# EAGLE design mic_v3 (EAGLE 9.6.2)
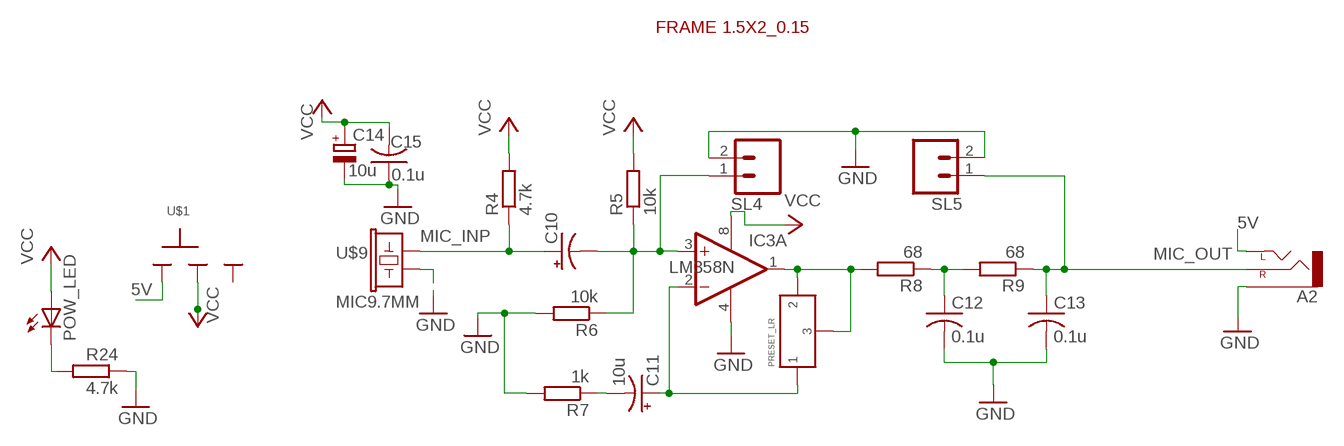
[diagram p0: schematic, sheet 1]

## Parts
A2  AUDIO-JACKPTH  [AUDIO-JACK]
C10  CPOL-USE2.5-5  [E2,5-5]
C11  10u  CPOL-USE2.5-5  [E2,5-5]
C12  0.1u  C-US025-024X044  [C025-024X044]
C13  0.1u  C-US025-024X044  [C025-024X044]
C14  10u  CPOL-EUE2.5-5  [E2,5-5]
C15  0.1u  C-US025-024X044  [C025-024X044]
IC3  LM358N  [DIL08]
POW_LED  LED3MM  [LED3MM]
R4  4.7k  R-EU_0204/7  [0204/7]
R5  10k  R-EU_0204/7  [0204/7]
R6  10k  R-EU_0204/7  [0204/7]
R7  1k  R-EU_0204/7  [0204/7]
R8  68  R-EU_0204/7  [0204/7]
R9  68  R-EU_0204/7  [0204/7]
R24  4.7k  R-EU_0204/7  [0204/7]
SL4  M02  [02P]
SL5  M02  [02P]
U$1  SLIDESWITCH-BIG  [BIGSWITCH]
U$2  FRAME_1.5X2_RAD_0.15  [FRAME_1.5X2_RAD_0.15]
U$6  PRESET_LR  [PRESET_LR]
U$9  MIC9.7MM  [MIC-9.7MM]

## Nets
5V: A2.TIP(LEFT) U$1.1
GND: A2.SLEEVE C12.2 C13.2 C14.- C15.1 IC3.4(P:V-) R6.2 R7.2 R24.1 SL4.2 SL5.2 U$9.2
MIC_INP: C10.+ R4.1 U$9.1
MIC_OUT: A2.RING(RIGHT) C13.1 R9.1 SL5.1
N$5: IC3.1(A:OUT) R8.2 U$6.P$2 U$6.P$3
N$6: C12.1 R8.1 R9.2
N$7: C11.- R7.1
N$8: POW_LED.K(C) R24.2
N$12: C10.- IC3.3(A:+IN) R5.1 R6.1 SL4.1
N$14: C11.+ IC3.2(A:-IN) U$6.P$1
VCC: C14.+ C15.2 IC3.8(P:V+) POW_LED.A R4.2 R5.2 U$1.2
Unconnected: IC3.5(B:+IN) IC3.6(B:-IN) IC3.7(B:OUT) U$1.3

## Library data of the parts
A2 = CEDT_JANUARY_2015_v6:AUDIO-JACK: 3.5mm Audio Jack Simple 3.5mm common PCB mount audio jack. SKU: PRT-08032
C10 C11 = rcl:CPOL-US: POLARIZED CAPACITOR, American symbol; SPICEPREFIX: C
C12 C13 C15 = rcl:C-US: CAPACITOR, American symbol; SPICEPREFIX: C
C14 = rcl:CPOL-EU: POLARIZED CAPACITOR, European symbol; SPICEPREFIX: C
IC3 = CEDT_JANUARY_2015_v6:LM358: OP AMP also LM158; LM258; LM2904 Source: http://cache.national.com/ds/LM/LM158.pdf
POW_LED = CEDT_JANUARY_2015_v6:LED
R4-R9 R24 = rcl:R-EU_: RESISTOR, European symbol; SPICEPREFIX: R
SL4 SL5 = con-amp-quick:M02: AMP QUICK CONNECTOR; OC_FARNELL: unknown; OC_NEWARK: unknown
U$1 = CEDT_JANUARY_2015_v6:SLIDESWITCH
U$2 = CEDT_JANUARY_2015_v6:FRAME_1.5X2_RAD_0.15
U$6 = CEDT_JANUARY_2015_v6:PRESET_LR
U$9 = CEDT_JANUARY_2015_v6:MIC: Microphone Omni-directional electret microphone. 9.7mm standard diameter.

## Board
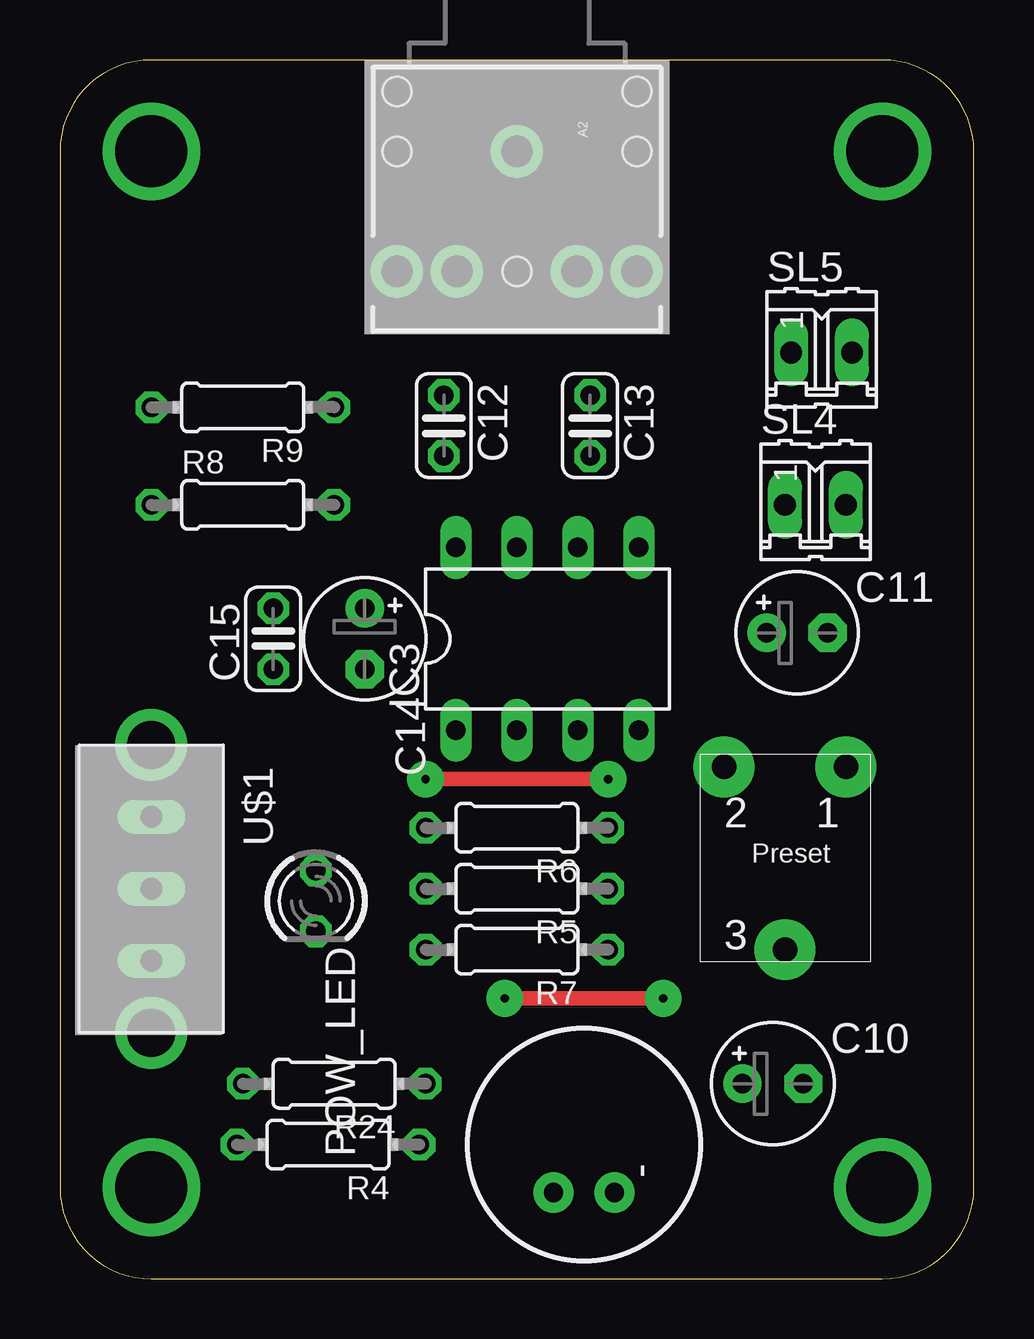
[diagram p1: board, top side]
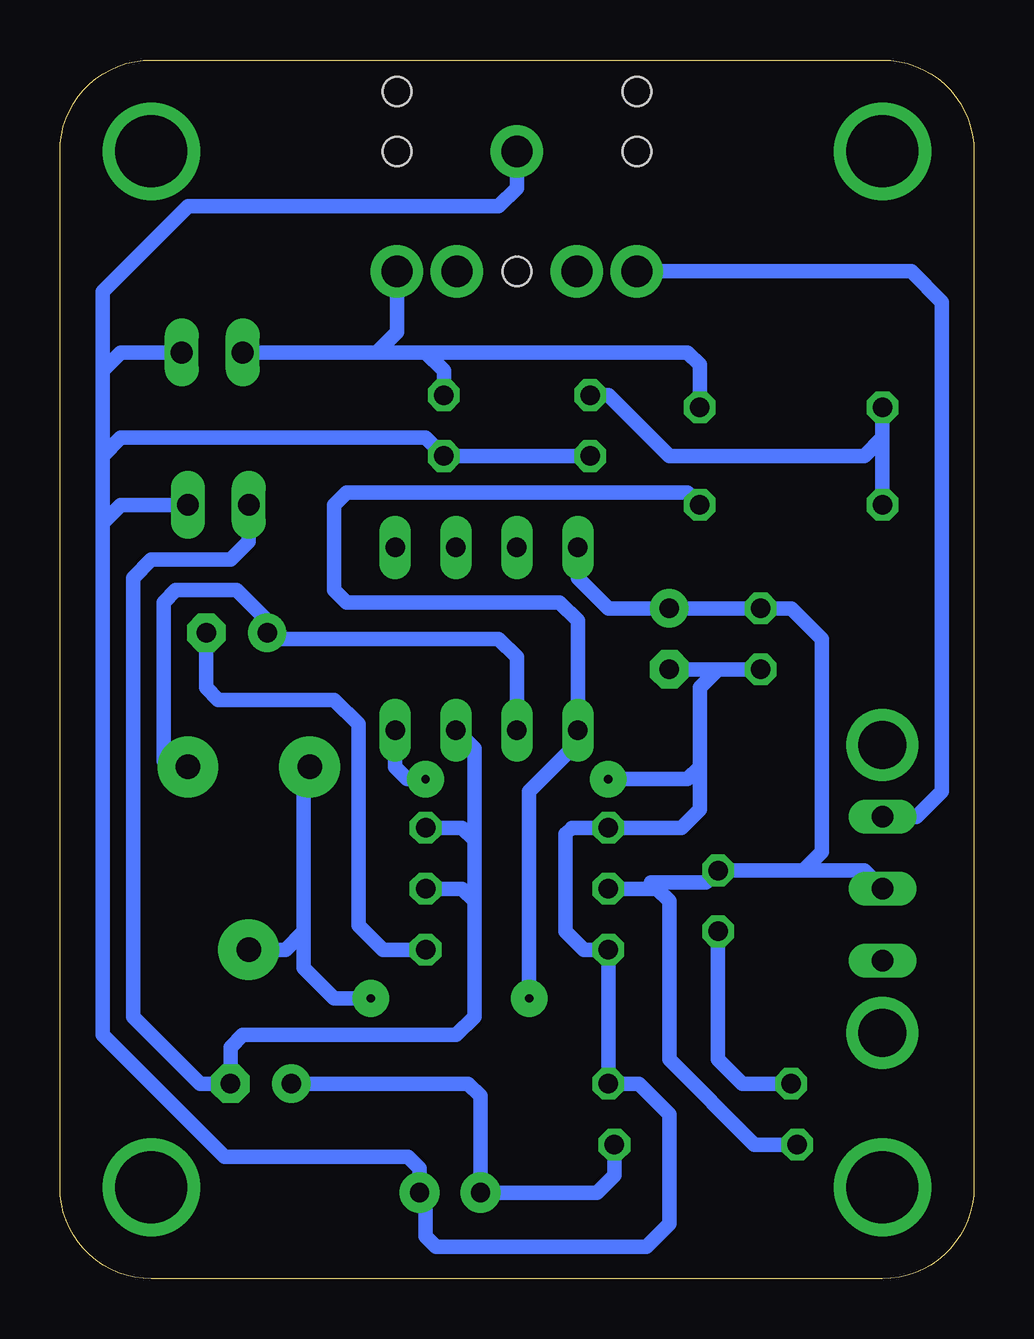
[diagram p2: board, bottom side, seen from below]

Size 38.1 x 50.8 mm. Coordinates in mm from the lower left corner, seen from the top.
Copper layers (1*16): Top 0.035mm / dielectric 1.5mm / Bottom 0.035mm
Design rules "default *": minimum track width 6mil, minimum drill 0.35mm, track to track 16mil, track to pad 16mil, pad to pad 16mil, via to via 16mil, smd to smd 16mil, copper to edge 40mil, drill to drill 6mil, minimum pad ring 10mil, minimum via ring 8mil, stop-mask expansion 4mil, vias tented up to drill 0mil, thermal gap 10mil

### Footprints (pad centres in the part's own frame; a part is rotated, then mirrored left to right if it is on the bottom)
AUDIO-JACK = drill 1.3 pad 2.184: RING 5,5; RSH 5,2.5; SLEEVE 0,0; TIP 5,-5; TSH 5,-2.5 | hole 1.2: 0,5; -2.5,5; -2.5,-5; 0,-5; 5,0
E2,5-5 = drill 0.813 pad 1.6: + -1.27,0 | drill 0.813 pad 1.6 octagon: - 1.27,0
C025-024X044 = drill 0.813 octagon: 1 -1.27,0; 2 1.27,0
DIL08 = drill 0.813 long: 1 -3.81,-3.81; 2 -1.27,-3.81; 3 1.27,-3.81; 4 3.81,-3.81; 5 3.81,3.81; 6 1.27,3.81; 7 -1.27,3.81; 8 -3.81,3.81
LED3MM = drill 0.813 octagon: A -1.27,0; K 1.27,0
0204/7 = drill 0.813 octagon: 1 -3.81,0; 2 3.81,0
02P = drill 0.914 long: 1 -1.27,0; 2 1.27,0
BIGSWITCH = drill 0.9 long: 1 -3,0; 2 0,0; 3 3,0 | drill 2 pad 2.184: TAB1 -6,0; TAB2 6,0
FRAME_1.5X2_RAD_0.15 = drill 2.997 pad 4.064: P$1 3.81,46.99; P$2 34.29,46.99; P$3 34.29,3.81; P$4 3.81,3.81
PRESET_LR = drill 1.016 pad 2.54: P$1 -2.54,-3.81; P$2 2.54,-3.81; P$3 0,3.81
MIC-9.7MM = drill 0.8 pad 1.676: 1 -2,1.27; 2 -2,-1.27

### Placement (x,y rotation side)
A2  19.05,46.99 270 top
C10  29.72,8.13 0 top
C11  30.73,26.92 0 top
C12  16,35.56 270 top
C13  22.1,35.56 270 top
C14  12.7,26.67 270 top
C15  8.89,26.67 90 top
IC3  20.32,26.67 0 top
POW_LED  10.67,15.75 270 top
R4  11.18,5.59 180 top
R5  19.05,16.26 180 top
R6  19.05,18.8 180 top
R7  19.05,13.72 180 top
R8  7.62,32.26 0 top
R9  7.62,36.32 180 top
R24  11.43,8.13 180 top
SL4  31.5,32.26 0 top
SL5  31.75,38.61 0 top
U$1  3.81,16.26 270 top
U$2  0,0 0 top
U$6  30.23,17.53 180 top
U$9  21.84,5.59 90 top

### Tracks (layer width: path | path; a pad name or v marks a point on that pad's centre or on a via)
5V
  Bottom 0.61: U$1.1 2.4,19.26 1.33,20.32 1.33,40.7 2.62,41.99 A2.TIP
GND  (via drill 0.35 pad 1.52)
  Top 0.61: v22.86,20.83 v15.24,20.83
  Bottom 0.61: 36.32,31.5 36.32,10.16 31.24,5.08 23.59,5.08 23.11,4.6 U$9.2 22.86,3.33 22.86,1.78 22.41,1.33 13.65,1.33 12.7,2.29 12.7,6.86 13.97,8.13 R24.1 R7.2 16.26,13.72 17.02,14.48 17.02,18.54 16.76,18.8 R6.2 12.19,18.8 11.43,19.56 11.43,21.34 | 36.32,31.5 36.32,34.29 | 36.32,34.29 36.32,37.85 | 36.32,37.85 36.32,41.15 32.77,44.7 19.81,44.7 19.05,45.47 A2.SLEEVE | SL5.2 35.56,38.61 36.32,37.85 | SL4.2 35.56,32.26 36.32,31.5 | C12.2 C13.2 22.86,35.05 35.56,35.05 36.32,34.29 | C15.1 10.67,25.4 | 10.67,25.4 C14.- | 10.67,25.4 11.43,24.64 11.43,21.34 | IC3.4 24.13,21.34 23.62,20.83 v22.86,20.83 | v15.24,20.83 11.94,20.83 11.43,21.34
MIC_INP
  Bottom 0.61: R4.1 14.99,4.32 15.72,3.59 U$9.1 20.57,7.62 21.08,8.13 C10.+
MIC_OUT
  Bottom 0.61: R9.1 11.43,38.1 11.94,38.61 22.86,38.61 | 22.86,38.61 24.89,38.61 | 24.89,38.61 SL5.1 | C13.1 22.1,37.85 22.86,38.61 | A2.RING 24.05,39.45 24.89,38.61
N$5  (via drill 0.35 pad 1.52)
  Top 0.61: v25.15,11.68 v18.54,11.68
  Bottom 0.61: U$6.P$2 27.94,21.08 27.94,14.48 | U$6.P$3 28.7,13.72 27.94,14.48 | R8.2 11.94,32.77 26.16,32.77 26.67,32.26 26.67,28.7 26.16,28.19 17.27,28.19 16.51,27.43 IC3.1 16.51,22.35 18.54,20.32 v18.54,11.68 | v25.15,11.68 26.67,11.68 27.94,12.95 27.94,14.48
N$6
  Bottom 0.61: R9.2 3.81,35.05 | 3.81,35.05 R8.1 | C12.1 15.24,36.83 12.7,34.29 4.57,34.29 3.81,35.05
N$7
  Bottom 0.61: R7.1 24.64,13.72 25.65,14.73 25.65,23.11 26.67,24.13 31.5,24.13 32,24.64 C11.-
N$8
  Bottom 0.61: R24.2 9.65,8.13 10.67,9.14 POW_LED.K
N$12
  Bottom 0.61: SL4.1 30.23,30.73 30.99,29.97 34.29,29.97 35.05,29.21 35.05,10.92 32.26,8.13 C10.- 30.99,9.65 30.48,10.16 21.59,10.16 20.83,10.92 20.83,15.75 | 20.83,15.75 20.83,18.29 | R6.1 21.34,18.8 20.83,18.29 | 20.83,15.75 21.34,16.26 R5.1 | IC3.3 20.83,22.1 20.83,18.29
N$14
  Bottom 0.61: IC3.2 19.05,25.91 19.81,26.67 29.21,26.67 C11.+ 29.46,27.43 30.73,28.7 33.27,28.7 33.78,28.19 33.78,21.59 33.53,21.34 U$6.P$1
VCC
  Bottom 0.61: 13.21,16.26 R5.2 | 13.21,16.26 12.7,15.75 12.7,9.14 9.14,5.59 R4.2 | 13.21,16.26 13.46,16.51 11.18,16.51 POW_LED.A 7.11,17.02 | U$1.2 4.57,17.02 7.11,17.02 | IC3.8 16.51,29.21 15.24,27.94 C14.+ C15.2 7.62,27.94 6.35,26.67 6.35,17.78 7.11,17.02